# EAGLE design WC Adaptor (EAGLE 9.6.2)
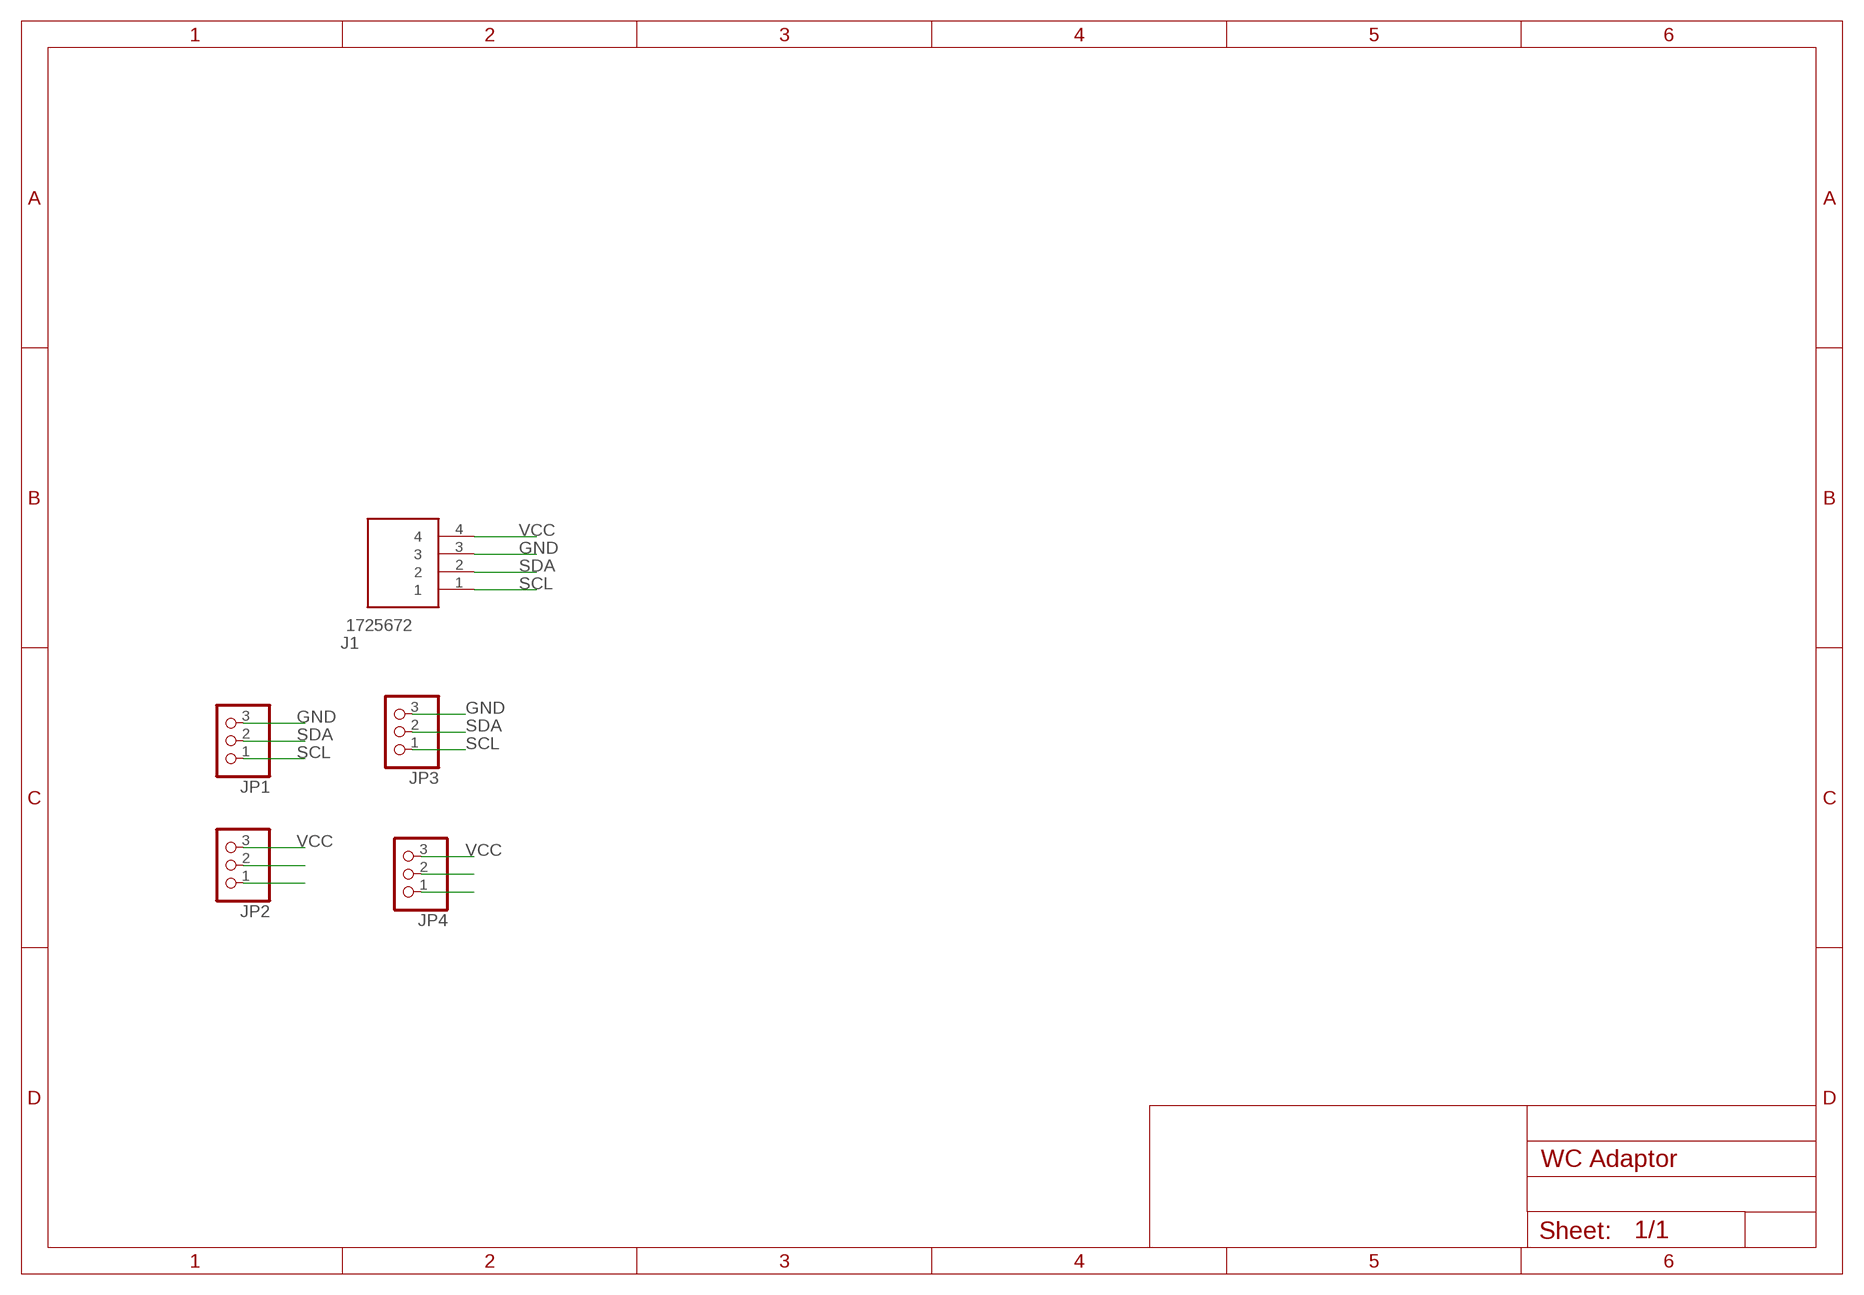
[diagram p0: schematic, sheet 1]

## Parts
J1  1725672  [1725672]
JP1  PINHD-1X3  [1X03]
JP2  PINHD-1X3  [1X03]
JP3  PINHD-1X3  [1X03]
JP4  PINHD-1X3  [1X03]

## Nets
GND: J1.3 JP1.3 JP3.3
N$5: JP2.2
N$6: JP2.1
N$11: JP4.2
N$12: JP4.1
SCL: J1.1 JP1.1 JP3.1
SDA: J1.2 JP1.2 JP3.2
VCC: J1.4 JP2.3 JP4.3

## Library data of the parts
J1 = Fixed Terminal 4P:1725672: 4 way vertical PCB terminal,6A 63V Phoenix Contact Non-Fused Terminal Block, 4 Way, Solder Terminals, 26 ??? 20 AWG Through Hole, Nylon, 63 V Source: Datasheet <https://datasheet.datasheetarchive.com/originals/distributors/SFDatasheet-2/sf-00050602.pdf>; DESCRIPTION: 4 way vertical PCB terminal,6A 63V Phoenix Contact Non-Fused Terminal Block, 4 Way, Solder Terminals, 26 ??? 20 AWG Through Hole, Nylon, 63 V; HEIGHT: 8.65mm; MANUFACTURER_NAME: Phoenix Contact; MANUFACTURER_PART_NUMBER: 1725672; MOUSER_PART_NUMBER: 651-1725672; MOUSER_PRICE-STOCK: https://www.mouser.co.uk/ProductDetail/Phoenix-Contact/1725672?qs=Ul7CXFMnlWXX93F9bOV2pQ%3D%3D
JP1-JP4 = adafruit:PINHD-1X3: PIN HEADER

## Board
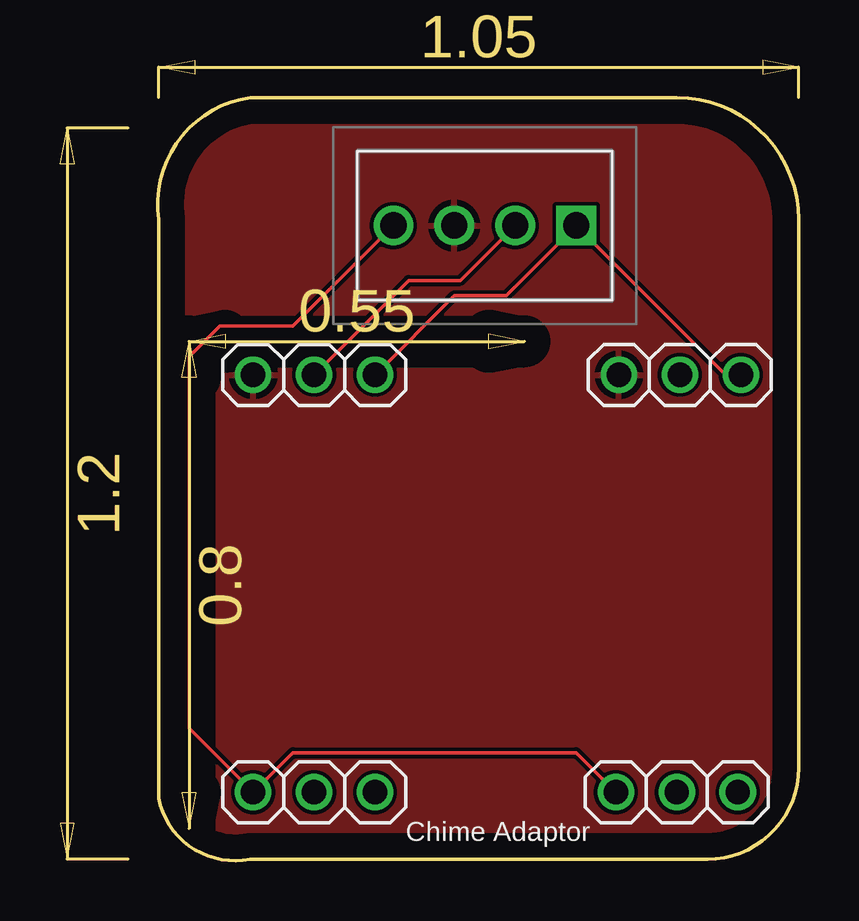
[diagram p1: board, top side]
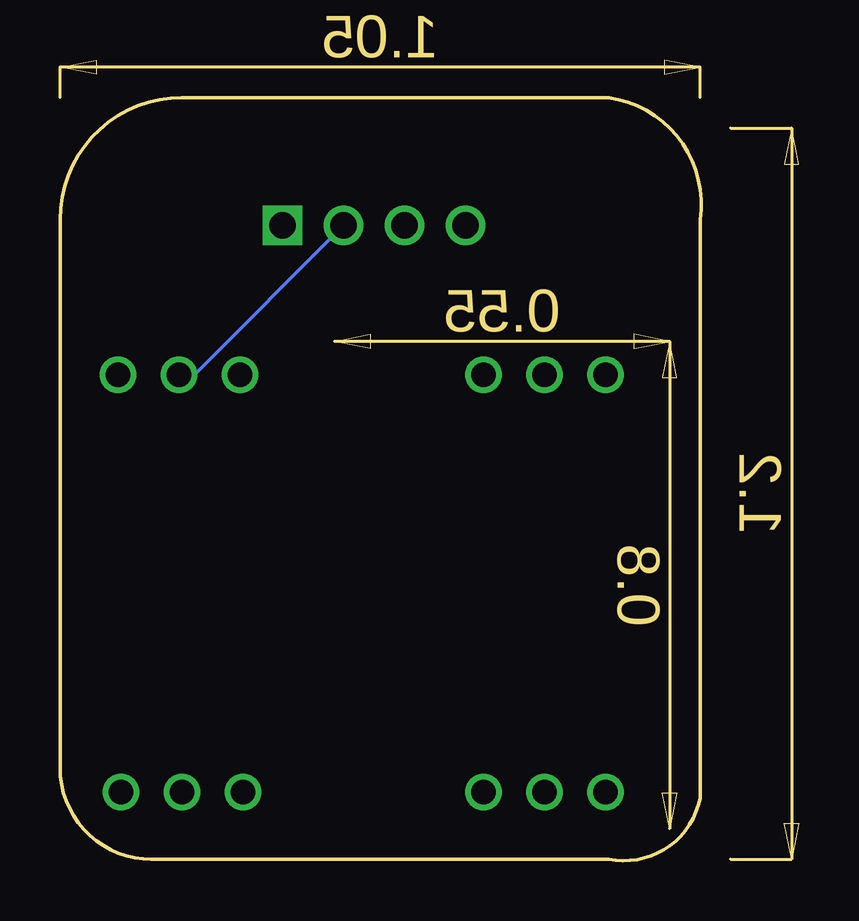
[diagram p2: board, bottom side, seen from below]

Size 26.71 x 31.81 mm. Coordinates in mm from the lower left corner, seen from the top.
Outline: 3.85,0.06 arc-90 0.04,2.6 0.04,26.73 arc-90 3.85,31.81 21.63,31.81 arc-90 26.71,26.73 26.71,3.87 arc-90 22.9,0.06 3.85,0.06
Copper layers (1*16): Top 0.035mm / dielectric 1.5mm / Bottom 0.035mm
Design rules "default": minimum track width 6mil, minimum drill 0.35mm, track to track 6mil, track to pad 6mil, pad to pad 6mil, via to via 6mil, smd to smd 6mil, copper to edge 40mil, drill to drill 6mil, minimum pad ring 10mil, minimum via ring 8mil, stop-mask expansion 4mil, vias tented up to drill 0mil, thermal gap 10mil

### Footprints (pad centres in the part's own frame; a part is rotated, then mirrored left to right if it is on the bottom)
1725672 = drill 1.1 pad 1.65 square: 1 0,0 | drill 1.1 pad 1.65: 2 2.54,0; 3 5.08,0; 4 7.62,0
1X03 = drill 1.016: 1 -2.54,0; 2 0,0; 3 2.54,0

### Placement (x,y rotation side)
J1  17.44,26.48 180 top
JP1  21.76,20.26 180 top
JP2  21.63,2.86 180 top
JP3  6.52,20.26 180 top
JP4  6.52,2.86 180 top

### Tracks (layer width: path | path; a pad name or v marks a point on that pad's centre or on a via)
GND
  pour Top: -1.23,35.62 27.98,35.62 27.98,-1.21 -1.23,-1.21
SCL
  Top 0.152: JP3.1 12.36,23.56 14.52,23.56 J1.1 23.66,20.26 JP1.1
SDA
  Top 0.152: JP3.2 10.45,24.19 12.61,24.19 J1.2
  Bottom 0.152: JP1.2 21.12,20.26 J1.2
VCC
  Top 0.152: JP2.3 17.44,4.51 5.63,4.51 JP4.3 1.31,5.52 1.31,21.02 2.58,22.29 5.63,22.29 J1.4

### Text on the board
tPlace: Chime Adaptor